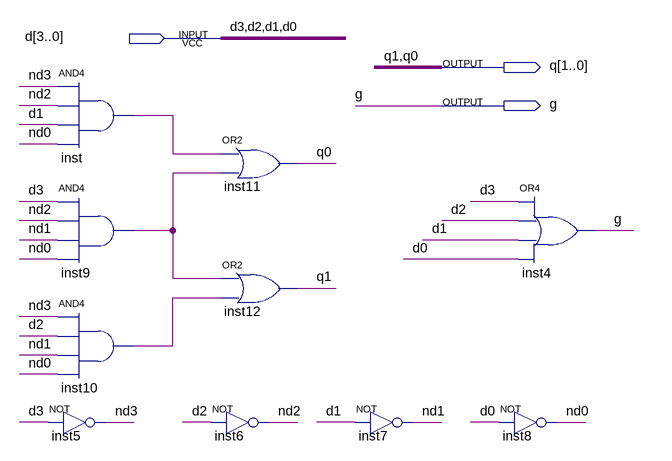
[diagram p0: schematic sheet]
// Quartus schematic s36_cd.bdf as structural Verilog: 10 symbols, 3 pins
module s36_cd (
  input  [3:0] d,
  output [1:0] q,
  output g
);

  wire inst9_out, inst10_out, inst_out, nd0, nd1, nd2, nd3;

  and inst (inst_out, nd3, nd2, d[1], nd0);
  and inst9 (inst9_out, d[3], nd2, nd1, nd0);
  and inst10 (inst10_out, nd3, d[2], nd1, nd0);
  not inst5 (nd3, d[3]);
  or inst11 (q[0], inst_out, inst9_out);
  or inst12 (q[1], inst9_out, inst10_out);
  not inst6 (nd2, d[2]);
  not inst7 (nd1, d[1]);
  or inst4 (g, d[3], d[2], d[1], d[0]);
  not inst8 (nd0, d[0]);
endmodule
